# Altium schematic sheet Limit_Switches.SchDoc
size B; Author: AM; CompanyName: Expatria Technologies; DrawnBy: A.Marles; Engineer: AM; Organization: Expatria Technologies; DocumentNumber: 5; Revision: A1; SheetNumber: 5; SheetTotal: 14; PCB_Rev: A1
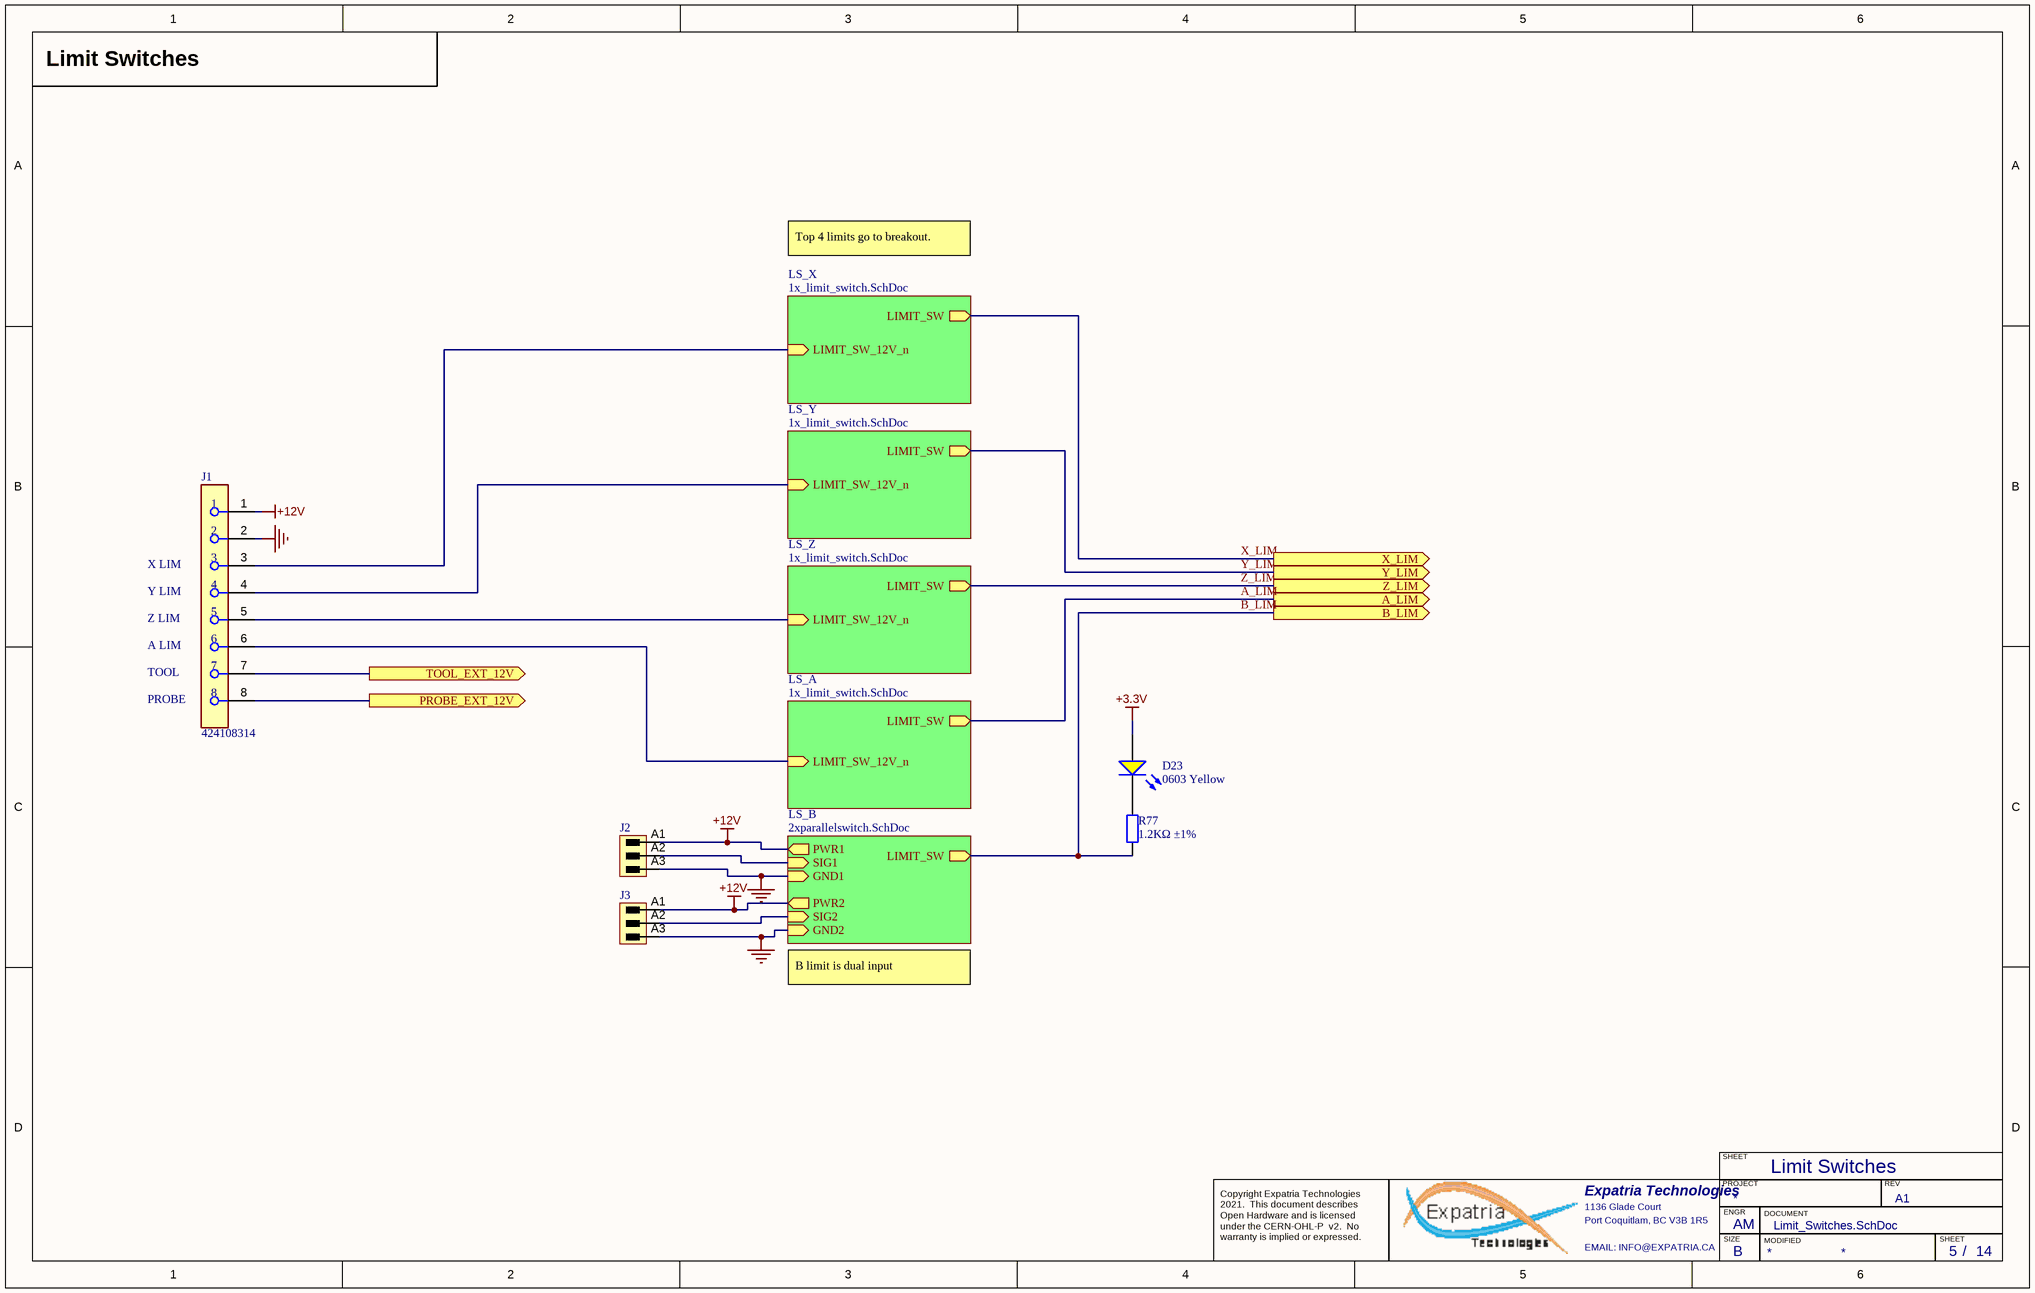
[diagram p0: Limit_Switches.SchDoc]

## Parts
D23  0603 Yellow  [0603_LED_S1]
J1  424108314  [FP-5555799-1-MFG]
J2  (no value)  [SL_3_50_180G_03]
J3  (no value)  [SL_3_50_180G_03]
R77  1.2KΩ ±1%  [0402_R]

## Sub-sheets
LS_A = 1x_limit_switch.SchDoc: LIMIT_SW (out), LIMIT_SW_12V_n (in)
LS_B = 2xparallelswitch.SchDoc: LIMIT_SW (out), SIG2 (in), GND2 (in), PWR2 (out), SIG1 (in), GND1 (in), PWR1 (out)
LS_X = 1x_limit_switch.SchDoc: LIMIT_SW (out), LIMIT_SW_12V_n (in)
LS_Y = 1x_limit_switch.SchDoc: LIMIT_SW (out), LIMIT_SW_12V_n (in)
LS_Z = 1x_limit_switch.SchDoc: LIMIT_SW (out), LIMIT_SW_12V_n (in)

## Ports
A_LIM (out), B_LIM (out), PROBE_EXT_12V (out), TOOL_EXT_12V (out), X_LIM (out), Y_LIM (out), Z_LIM (out)

## Nets
+3.3V: D23.A
+12V: J1.1 J2.A1 J3.A1 ; sheet LS_B/PWR2, sheet LS_B/PWR1
GND: J1.2 J2.A3 J3.A3 ; sheet LS_B/GND2, sheet LS_B/GND1
A_LIM: port A_LIM, sheet LS_A/LIMIT_SW
B_LIM: R77.1 ; port B_LIM, sheet LS_B/LIMIT_SW
PROBE_EXT_12V: J1.8 ; port PROBE_EXT_12V
TOOL_EXT_12V: J1.7 ; port TOOL_EXT_12V
X_LIM: port X_LIM, sheet LS_X/LIMIT_SW
Y_LIM: port Y_LIM, sheet LS_Y/LIMIT_SW
Z_LIM: port Z_LIM, sheet LS_Z/LIMIT_SW
NetD23_K: D23.K R77.2
NetJ1_3: J1.3 ; sheet LS_X/LIMIT_SW_12V_n
NetJ1_4: J1.4 ; sheet LS_Y/LIMIT_SW_12V_n
NetJ1_5: J1.5 ; sheet LS_Z/LIMIT_SW_12V_n
NetJ1_6: J1.6 ; sheet LS_A/LIMIT_SW_12V_n
NetJ2_A2: J2.A2 ; sheet LS_B/SIG1
NetJ3_A2: J3.A2 ; sheet LS_B/SIG2

## Notes on the sheet
- Limit Switches
- Top 4 limits go to breakout.
- (near J1) X LIM
- (near J1) Y LIM
- (near J1) Z LIM
- (near J1) A LIM
- TOOL
- (near J1) PROBE
- B limit is dual input
- SHEET
- Expatria Technologies
- 1136 Glade Court
- Port Coquitlam, BC V3B 1R5
- PROJECT
- SIZE
- ENGR
- MODIFIED
- DOCUMENT
- REV
- Copyright Expatria Technologies 2021.  This document describes Open Hardware and is licensed under the CERN-OHL-P  v2.  No warranty is implied or expressed.
- EMAIL: INFO@EXPATRIA.CA
- B
- /

## Library data of the parts
D23 = 0603 LED Yellow: LED; Package: 0603; Supplier: LC; SuppliersPartNumber: C72038; Color: Yellow
J1 = CMP-03371-000003-1: CONN MOD JACK 8P8C VERT UNSHLD; SuppliersPartNumber: C563815; Supplier: LCSC
J2 J3 = CMP-1559-00904-1: Header,Male Pin,Covered(4 Sided) 3 1 0.138"（3.50mm） 3 P=3.5mm Pluggable System Terminal Block RoHS; PartNumber: WJ15EDGVC-3.5-3P; Manufacturer: Ningbo Kangnex Elec; Pitch_mm: 3.5 mm; UL_94_flammability_rating: V-0; Side_termination_characteristic: closed side; Solder_pin_length_mm: 3.2 mm; Short_text_for_material: SL 3.50/03/180G 3.2SN OR BX; Pitch_inch: 0.138 inch; PackageReference: SL_3_50_180G_03; Packaging: Box; Revision: V1; SuppliersPartNumber: C192778
R77 = 0402 1.2K (1201) 1%: Chip resistor; Manufacturer: Uniroyal Elec; PartNumber: 0402WGF1201TCE; Power: 1/16W; Package: 0402; Supplier: LC; SuppliersPartNumber: C25862; Resistance: 1.2KΩ; Tolerance: 1%